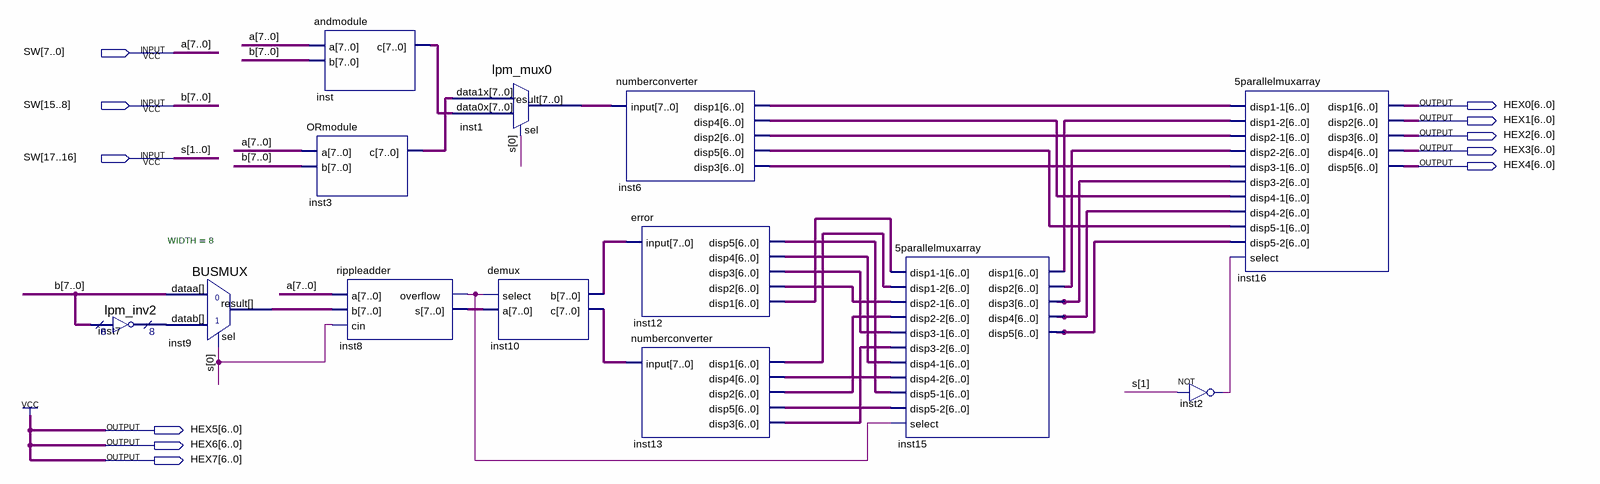
[diagram p0: schematic sheet]
// Quartus schematic Lab4.bdf as structural Verilog: 13 symbols, 11 pins
module Lab4 (
  input  [17:0] SW,
  output [6:0] HEX0,
  output [6:0] HEX1,
  output [6:0] HEX2,
  output [6:0] HEX3,
  output [6:0] HEX4,
  output [6:0] HEX5,
  output [6:0] HEX6,
  output [6:0] HEX7
);

  wire inst2_out, inst8_overflow;
  wire [6:0] inst6_disp1, inst6_disp2, inst6_disp3, inst6_disp4, inst6_disp5, inst12_disp1, inst12_disp2,
       inst12_disp3, inst12_disp4, inst12_disp5, inst13_disp1, inst13_disp2, inst13_disp3, inst13_disp4,
       inst13_disp5, inst15_disp1, inst15_disp2, inst15_disp3, inst15_disp4, inst15_disp5;
  wire [7:0] inst1_result, inst3_c, inst7_result, inst8_s, inst9_result, inst10_b, inst10_c, inst_c;

  lpm_inv2 inst7 (.data(SW[15:8]), .result(inst7_result));
  BUSMUX #(.WIDTH(8)) inst9 (.datab(inst7_result), .sel(SW[16]), .dataa(SW[15:8]), .result(inst9_result));
  andmodule inst (.a(SW[7:0]), .b(SW[15:8]), .c(inst_c));
  ORmodule inst3 (.a(SW[7:0]), .b(SW[15:8]), .c(inst3_c));
  rippleadder inst8 (.a(SW[7:0]), .b(inst9_result), .cin(SW[16]), .overflow(inst8_overflow), .s(inst8_s));
  lpm_mux0 inst1 (.data1x(inst3_c), .data0x(inst_c), .sel(SW[16]), .result(inst1_result));
  demux inst10 (.select(inst8_overflow), .a(inst8_s), .b(inst10_b), .c(inst10_c));
  numberconverter inst6 (
    .\input (inst1_result), .disp1(inst6_disp1), .disp4(inst6_disp4), .disp2(inst6_disp2),
    .disp5(inst6_disp5), .disp3(inst6_disp3));
  error inst12 (
    .\input (inst10_b), .disp5(inst12_disp5), .disp4(inst12_disp4), .disp3(inst12_disp3),
    .disp2(inst12_disp2), .disp1(inst12_disp1));
  numberconverter inst13 (
    .\input (inst10_c), .disp1(inst13_disp1), .disp4(inst13_disp4), .disp2(inst13_disp2),
    .disp5(inst13_disp5), .disp3(inst13_disp3));
  \5parallelmuxarray  inst15 (
    .\disp1-1 (inst12_disp1), .\disp1-2 (inst13_disp1), .\disp2-1 (inst12_disp2), .\disp2-2 (inst13_disp2),
    .\disp3-1 (inst12_disp3), .\disp3-2 (inst13_disp3), .\disp4-1 (inst12_disp4), .\disp4-2 (inst13_disp4),
    .\disp5-1 (inst12_disp5), .\disp5-2 (inst13_disp5), .select(inst8_overflow), .disp1(inst15_disp1),
    .disp2(inst15_disp2), .disp3(inst15_disp3), .disp4(inst15_disp4), .disp5(inst15_disp5));
  not inst2 (inst2_out, SW[17]);
  \5parallelmuxarray  inst16 (
    .\disp1-1 (inst6_disp1), .\disp1-2 (inst15_disp1), .\disp2-1 (inst6_disp2), .\disp2-2 (inst15_disp2),
    .\disp3-1 (inst6_disp3), .\disp3-2 (inst15_disp3), .\disp4-1 (inst6_disp4), .\disp4-2 (inst15_disp4),
    .\disp5-1 (inst6_disp5), .\disp5-2 (inst15_disp5), .select(inst2_out), .disp1(HEX0), .disp2(HEX1),
    .disp3(HEX2), .disp4(HEX3), .disp5(HEX4));

  assign HEX5 = {7{1'b1}};
  assign HEX6 = {7{1'b1}};
  assign HEX7 = {7{1'b1}};

  // Other names for the same wires on the sheet: a[7:0] = SW[7:0]; b[7:0] = SW[15:8]; s[1:0] = SW[17:16]
endmodule
